# Altium schematic sheet Roby-Eva.SchDoc
size A2
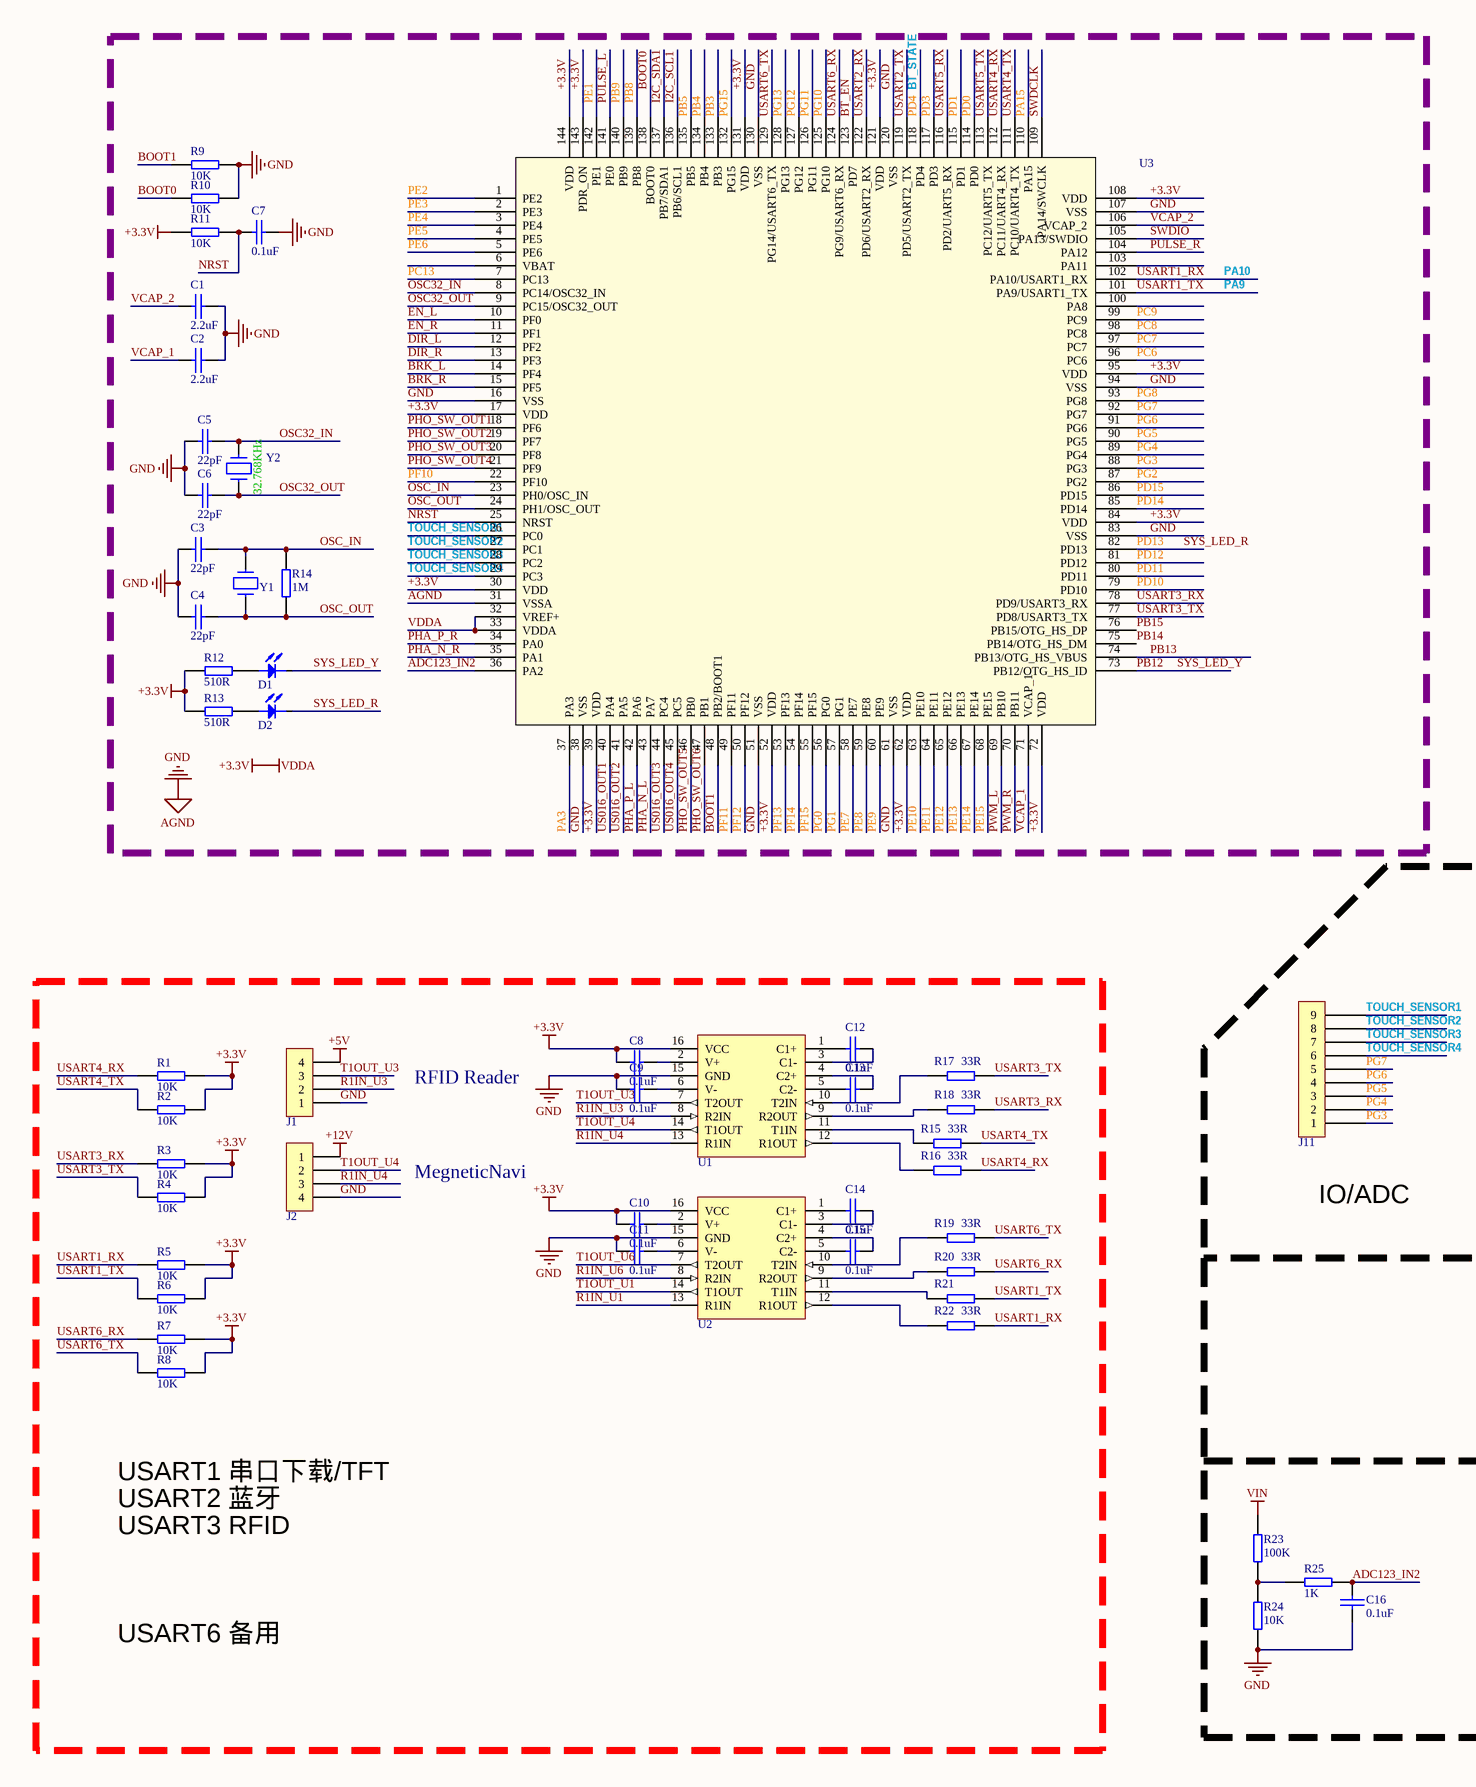
[diagram p0: Roby-Eva.SchDoc, left]
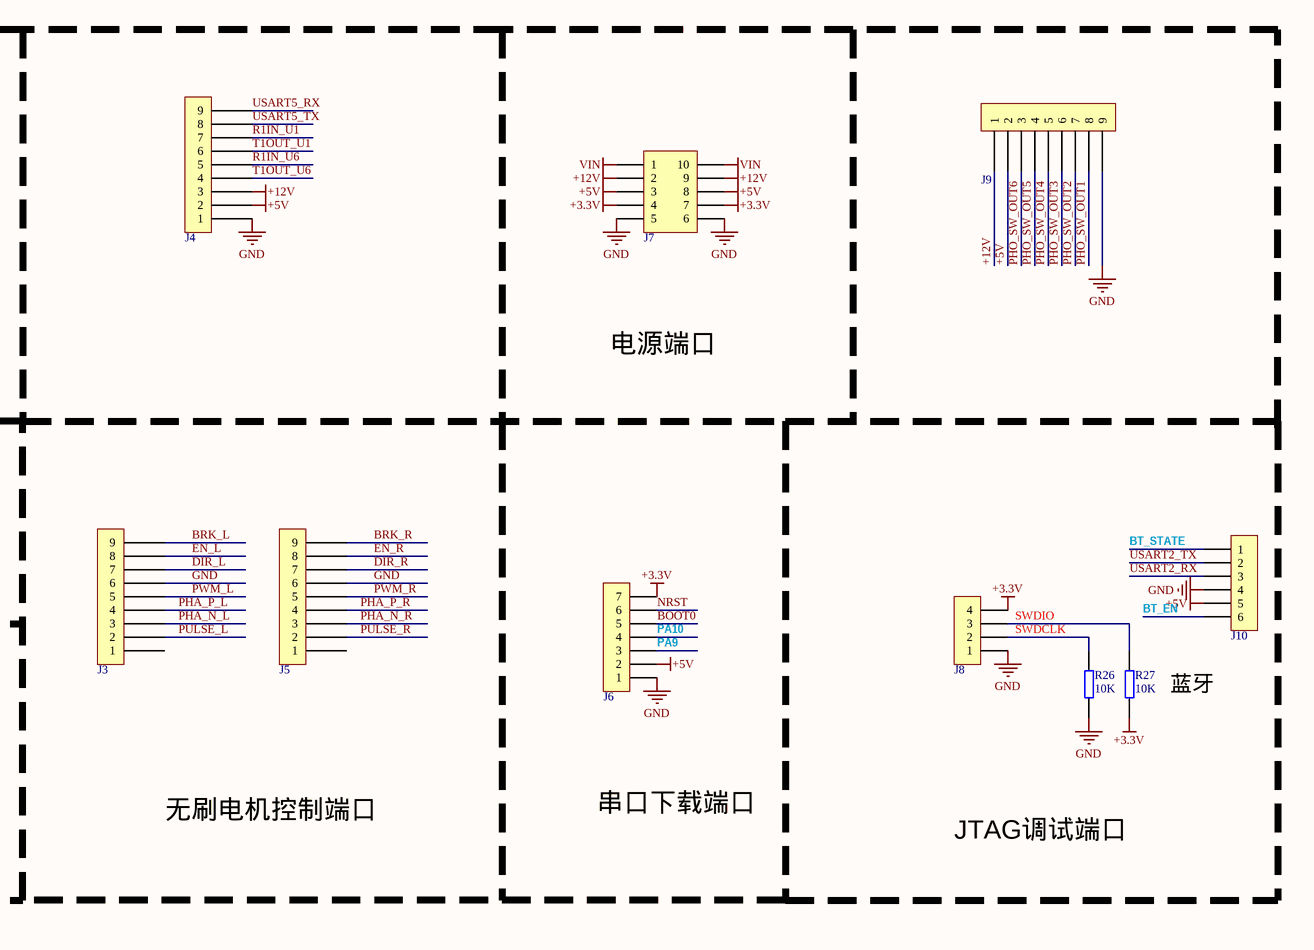
[diagram p1: Roby-Eva.SchDoc, right]

## Parts
C1  贴片电容0805  [0805C]  (value not drawn)
C2  贴片电容0805  [0805C]  (value not drawn)
C3  贴片电容0805  [0805C]  (value not drawn)
C4  贴片电容0805  [0805C]  (value not drawn)
C5  贴片电容0805  [0805C]  (value not drawn)
C6  贴片电容0805  [0805C]  (value not drawn)
C7  贴片电容0805  [0805C]  (value not drawn)
C8  贴片电容0805  [0805C]  (value not drawn)
C9  贴片电容0805  [0805C]  (value not drawn)
C10  贴片电容0805  [0805C]  (value not drawn)
C11  贴片电容0805  [0805C]  (value not drawn)
C12  贴片电容0805  [0805C]  (value not drawn)
C13  贴片电容0805  [0805C]  (value not drawn)
C14  贴片电容0805  [0805C]  (value not drawn)
C15  贴片电容0805  [0805C]  (value not drawn)
C16  贴片电容0805  [0805C]  (value not drawn)
D1  LED_DIP  [LED_DIP]  (value not drawn)
D2  LED_DIP  [LED_DIP]  (value not drawn)
J1  XH2.54-4P-L  [XH2.54-4P-L]  (value not drawn)
J2  XH2.54-4P-L  [XH2.54-4P-L]  (value not drawn)
J3  XH2.54-9P-L  [XH2.54-9P-L]  (value not drawn)
J4  XH2.54-9P-D  [XH2.54-9P-D]  (value not drawn)
J5  XH2.54-9P-L  [XH2.54-9P-L]  (value not drawn)
J6  CON7  [HDR1X7H]  (value not drawn)
J7  CON 2x5  [CON 2X5]  (value not drawn)
J8  CON4  [HDR1X4H]  (value not drawn)
J9  XH2.54-9P-L  [XH2.54-9P-L]  (value not drawn)
J10  CON6  [HDR1X6H]  (value not drawn)
J11  XH2.54-9P-D  [XH2.54-9P-D]  (value not drawn)
R1  贴片电阻0805  [0805R]  (value not drawn)
R2  贴片电阻0805  [0805R]  (value not drawn)
R3  贴片电阻0805  [0805R]  (value not drawn)
R4  贴片电阻0805  [0805R]  (value not drawn)
R5  贴片电阻0805  [0805R]  (value not drawn)
R6  贴片电阻0805  [0805R]  (value not drawn)
R7  贴片电阻0805  [0805R]  (value not drawn)
R8  贴片电阻0805  [0805R]  (value not drawn)
R9  贴片电阻0805  [0805R]  (value not drawn)
R10  贴片电阻0805  [0805R]  (value not drawn)
R11  贴片电阻0805  [0805R]  (value not drawn)
R12  贴片电阻0805  [0805R]  (value not drawn)
R13  贴片电阻0805  [0805R]  (value not drawn)
R14  贴片电阻0805  [0805R]  (value not drawn)
R15  贴片电阻0805  [0805R]  (value not drawn)
R16  贴片电阻0805  [0805R]  (value not drawn)
R17  贴片电阻0805  [0805R]  (value not drawn)
R18  贴片电阻0805  [0805R]  (value not drawn)
R19  贴片电阻0805  [0805R]  (value not drawn)
R20  贴片电阻0805  [0805R]  (value not drawn)
R21  贴片电阻0805  [0805R]  (value not drawn)
R22  贴片电阻0805  [0805R]  (value not drawn)
R23  贴片电阻0805  [0805R]  (value not drawn)
R24  贴片电阻0805  [0805R]  (value not drawn)
R25  贴片电阻0805  [0805R]  (value not drawn)
R26  贴片电阻0805  [0805R]  (value not drawn)
R27  贴片电阻0805  [0805R]  (value not drawn)
U1  MAX232  [SOP16]  (value not drawn)
U2  MAX232  [SOP16]  (value not drawn)
U3  STM32F407  [LQFP144]  (value not drawn)
Y1  CRYSAL_SOP_2  [CRYSAL_SOP_2]  (value not drawn)
Y2  CRYSAL_DIP_MINI  [CRYSAL_DIP_MINI]  (value not drawn)

## Nets
+3.3V: C8.2 C10.2 J6.7 J7.4 J7.7 J8.4 R1.2 R2.2 R3.2 R4.2 R5.2 R6.2 R7.2 R8.2 R11.1 R12.1 R13.1 R27.1 U1.16(VCC) U2.16(VCC) U3.17(VDD) U3.30(VDD) U3.32(VREF+) U3.33(VDDA) U3.39(VDD) U3.52(VDD) U3.62(VDD) U3.72(VDD) U3.84(VDD) U3.95(VDD) U3.108(VDD) U3.121(VDD) U3.131(VDD) U3.143(PDR_ON) U3.144(VDD)  [also labelled VDDA]
+5V: J1.4 J4.2 J6.2 J7.3 J7.8 J9.2 J10.5
+12V: J2.1 J4.3 J7.2 J7.9 J9.1
AGND: C1.1 C2.1 C3.2 C4.2 C5.2 C6.2 C7.1 C9.2 C11.2 C16.2 J1.1 J2.4 J3.6 J4.1 J5.6 J6.1 J7.5 J7.6 J8.1 J9.9 J10.4 R9.2 R10.2 R24.2 R26.1 U1.15(GND) U2.15(GND) U3.16(VSS) U3.31(VSSA) U3.38(VSS) U3.51(VSS) U3.61(VSS) U3.83(VSS) U3.94(VSS) U3.107(VSS) U3.120(VSS) U3.130(VSS)  [also labelled GND]
VIN: J7.1 J7.10 R23.2
ADC123_IN2: C16.1 R25.2 U3.36(PA2)
BOOT0: J6.5 R10.1 U3.138(BOOT0)
BOOT1: R9.1 U3.48(PB2/BOOT1)
BRK_L: J3.9 U3.14(PF4)
BRK_R: J5.9 U3.15(PF5)
BT_EN: J10.6 U3.123(PD7)
BT_STATE: J10.1 U3.118(PD4)  [also labelled PD4]
DIR_L: J3.7 U3.12(PF2)
DIR_R: J5.7 U3.13(PF3)
EN_L: J3.8 U3.10(PF0)
EN_R: J5.8 U3.11(PF1)
I2C_SCL1: U3.136(PB6/SCL1)
I2C_SDA1: U3.137(PB7/SDA1)
NRST: C7.2 J6.6 R11.2 U3.25(NRST)
OSC32_IN: C5.1 U3.8(PC14/OSC32_IN) Y2.2
OSC32_OUT: C6.1 U3.9(PC15/OSC32_OUT) Y2.1
OSC_IN: C3.1 R14.2 U3.23(PH0/OSC_IN) Y1.2
OSC_OUT: C4.1 R14.1 U3.24(PH1/OSC_OUT) Y1.1
PA3: U3.37(PA3)
PA9: J6.3 R6.1 R21.2 U3.101(PA9/USART1_TX)  [also labelled USART1_TX]
PA10: J6.4 R5.1 R22.2 U3.102(PA10/USART1_RX)  [also labelled USART1_RX]
PA15: U3.110(PA15)
PB3: U3.133(PB3)
PB4: U3.134(PB4)
PB5: U3.135(PB5)
PB8: U3.139(PB8)
PB9: U3.140(PB9)
PB12: D1.2 U3.73(PB12/OTG_HS_ID)  [also labelled SYS_LED_Y]
PB13: U3.74(PB13/OTG_HS_VBUS)
PB14: U3.75(PB14/OTG_HS_DM)
PB15: U3.76(PB15/OTG_HS_DP)
PC6: U3.96(PC6)
PC7: U3.97(PC7)
PC8: U3.98(PC8)
PC9: U3.99(PC9)
PC13: U3.7(PC13)
PD0: U3.114(PD0)
PD1: U3.115(PD1)
PD3: U3.117(PD3)
PD10: U3.79(PD10)
PD11: U3.80(PD11)
PD12: U3.81(PD12)
PD13: D2.2 U3.82(PD13)  [also labelled SYS_LED_R]
PD14: U3.85(PD14)
PD15: U3.86(PD15)
PE1: U3.142(PE1)
PE2: U3.1(PE2)
PE3: U3.2(PE3)
PE4: U3.3(PE4)
PE5: U3.4(PE5)
PE6: U3.5(PE6)
PE7: U3.58(PE7)
PE8: U3.59(PE8)
PE9: U3.60(PE9)
PE10: U3.63(PE10)
PE11: U3.64(PE11)
PE12: U3.65(PE12)
PE13: U3.66(PE13)
PE14: U3.67(PE14)
PE15: U3.68(PE15)
PF10: U3.22(PF10)
PF11: U3.49(PF11)
PF12: U3.50(PF12)
PF13: U3.53(PF13)
PF14: U3.54(PF14)
PF15: U3.55(PF15)
PG0: U3.56(PG0)
PG1: U3.57(PG1)
PG2: U3.87(PG2)
PG3: J11.1 U3.88(PG3)
PG4: J11.2 U3.89(PG4)
PG5: J11.3 U3.90(PG5)
PG6: J11.4 U3.91(PG6)
PG7: J11.5 U3.92(PG7)
PG8: U3.93(PG8)
PG10: U3.125(PG10)
PG11: U3.126(PG11)
PG12: U3.127(PG12)
PG13: U3.128(PG13)
PG15: U3.132(PG15)
PHA_N_L: J3.3 U3.43(PA7)
PHA_N_R: J5.3 U3.35(PA1)
PHA_P_L: J3.4 U3.42(PA6)
PHA_P_R: J5.4 U3.34(PA0)
PHO_SW_OUT1: J9.8 U3.18(PF6)
PHO_SW_OUT2: J9.7 U3.19(PF7)
PHO_SW_OUT3: J9.6 U3.20(PF8)
PHO_SW_OUT4: J9.5 U3.21(PF9)
PHO_SW_OUT5: J9.4 U3.46(PB0)
PHO_SW_OUT6: J9.3 U3.47(PB1)
PULSE_L: J3.2 U3.141(PE0)
PULSE_R: J5.2 U3.104(PA12)
PWM_L: J3.5 U3.69(PB10)
PWM_R: J5.5 U3.70(PB11)
R1IN_U1: J4.7 U2.13(R1IN)
R1IN_U3: J1.2 U1.8(R2IN)
R1IN_U4: J2.3 U1.13(R1IN)
R1IN_U6: J4.5 U2.8(R2IN)
SWDCLK: J8.2 R26.2 U3.109(PA14/SWCLK)
SWDIO: J8.3 R27.2 U3.105(PA13/SWDIO)
T1OUT_U1: J4.6 U2.14(T1OUT)
T1OUT_U3: J1.3 U1.7(T2OUT)
T1OUT_U4: J2.2 U1.14(T1OUT)
T1OUT_U6: J4.4 U2.7(T2OUT)
TOUCH_SENSOR1: J11.9 U3.26(PC0)
TOUCH_SENSOR2: J11.8 U3.27(PC1)
TOUCH_SENSOR3: J11.7 U3.28(PC2)
TOUCH_SENSOR4: J11.6 U3.29(PC3)
US016_OUT1: U3.40(PA4)
US016_OUT2: U3.41(PA5)
US016_OUT3: U3.44(PC4)
US016_OUT4: U3.45(PC5)
USART2_RX: J10.3 U3.122(PD6/USART2_RX)
USART2_TX: J10.2 U3.119(PD5/USART2_TX)
USART3_RX: R3.1 R18.2 U3.78(PD9/USART3_RX)
USART3_TX: R4.1 R17.2 U3.77(PD8/USART3_TX)
USART4_RX: R1.1 R16.2 U3.112(PC11/UART4_RX)
USART4_TX: R2.1 R15.2 U3.111(PC10/UART4_TX)
USART5_RX: J4.9 U3.116(PD2/UART5_RX)
USART5_TX: J4.8 U3.113(PC12/UART5_TX)
USART6_RX: R7.1 R20.2 U3.124(PG9/USART6_RX)
USART6_TX: R8.1 R19.2 U3.129(PG14/USART6_TX)
VCAP_1: C2.2 U3.71(VCAP_1)
VCAP_2: C1.2 U3.106(VCAP_2)
NetC8_1: C8.1 U1.2(V+)
NetC9_1: C9.1 U1.6(V-)
NetC10_1: C10.1 U2.2(V+)
NetC11_1: C11.1 U2.6(V-)
NetC12_1: C12.1 U1.3(C1-)
NetC12_2: C12.2 U1.1(C1+)
NetC13_1: C13.1 U1.4(C2+)
NetC13_2: C13.2 U1.5(C2-)
NetC14_1: C14.1 U2.3(C1-)
NetC14_2: C14.2 U2.1(C1+)
NetC15_1: C15.1 U2.4(C2+)
NetC15_2: C15.2 U2.5(C2-)
NetD1_1: D1.1 R12.2
NetD2_1: D2.1 R13.2
NetR15_1: R15.1 U1.11(T1IN)
NetR16_1: R16.1 U1.12(R1OUT)
NetR17_1: R17.1 U1.10(T2IN)
NetR18_1: R18.1 U1.9(R2OUT)
NetR19_1: R19.1 U2.10(T2IN)
NetR20_1: R20.1 U2.9(R2OUT)
NetR21_1: R21.1 U2.11(T1IN)
NetR22_1: R22.1 U2.12(R1OUT)
NetR23_1: R23.1 R24.1 R25.1

Not connected (* = marked no-connect by the designer): J3 1; J5 1; U3 6(VBAT) 100(PA8) 103(PA11)

## Notes on the sheet
- RFID Reader
- MegneticNavi
- IO/ADC
- 电源端口
- USART1 串口下载/TFT
- USART2 蓝牙
- USART3 RFID
- (near R27) 蓝牙
- USART6 备用
- 串口下载端口
- 无刷电机控制端口
- JTAG调试端口
- (in symbol CRYSAL_DIP_MINI) 32.768KHz
- (in symbol 贴片电容0805) 0.1uF; 2.2uF; 22pF
- (in symbol 贴片电阻0805) 10K; 1M; 510R; 33R; 100K; 1K